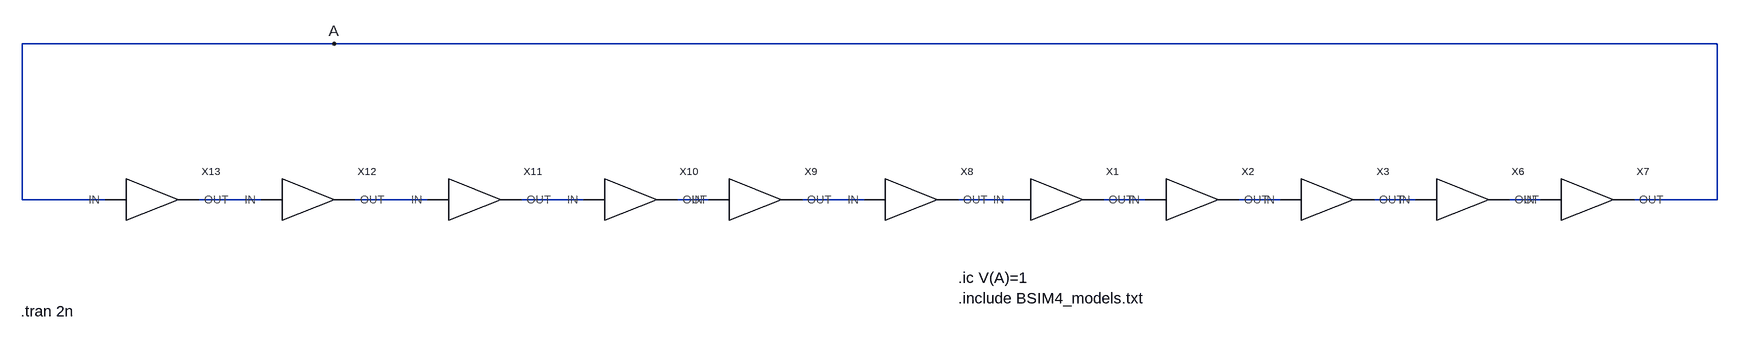
[diagram p0: schematic Draft28.asc]
Draft28.asc, the LTspice schematic file:
Version 4
SHEET 1 1172 680
WIRE -960 -96 -1440 -96
WIRE 1168 -96 -960 -96
WIRE -1440 144 -1440 -96
WIRE -1312 144 -1440 144
WIRE -1072 144 -1168 144
WIRE -816 144 -928 144
WIRE -576 144 -672 144
WIRE -384 144 -432 144
WIRE -144 144 -240 144
WIRE 80 144 0 144
WIRE 288 144 224 144
WIRE 496 144 432 144
WIRE 704 144 640 144
WIRE 896 144 848 144
WIRE 1168 144 1168 -96
WIRE 1168 144 1040 144
FLAG -960 -96 A
SYMBOL CMOS 224 176 R0
SYMATTR InstName X1
SYMBOL CMOS 432 176 R0
SYMATTR InstName X2
SYMBOL CMOS 640 176 R0
SYMATTR InstName X3
SYMBOL CMOS 848 176 R0
SYMATTR InstName X6
SYMBOL CMOS 1040 176 R0
SYMATTR InstName X7
SYMBOL CMOS 0 176 R0
SYMATTR InstName X8
SYMBOL CMOS -240 176 R0
SYMATTR InstName X9
SYMBOL CMOS -432 176 R0
SYMATTR InstName X10
SYMBOL CMOS -672 176 R0
SYMATTR InstName X11
SYMBOL CMOS -928 176 R0
SYMATTR InstName X12
SYMBOL CMOS -1168 176 R0
SYMATTR InstName X13
TEXT 0 296 Left 2 !.include BSIM4_models.txt
TEXT 0 264 Left 2 !.ic V(A)=1
TEXT -1442 316 Left 2 !.tran 2n

The netlist it stands for:
* Draft28.asc
XX1 N006 N007 CMOS  ; pins IN OUT
XX2 N007 N008 CMOS  ; pins IN OUT
XX3 N008 N009 CMOS  ; pins IN OUT
XX6 N009 N010 CMOS  ; pins IN OUT
XX7 N010 A CMOS  ; pins IN OUT
XX8 N005 N006 CMOS  ; pins IN OUT
XX9 N004 N005 CMOS  ; pins IN OUT
XX10 N003 N004 CMOS  ; pins IN OUT
XX11 N002 N003 CMOS  ; pins IN OUT
XX12 N001 N002 CMOS  ; pins IN OUT
XX13 A N001 CMOS  ; pins IN OUT
.include BSIM4_models.txt
.ic V(A)=1
.tran 2n
.backanno
.end